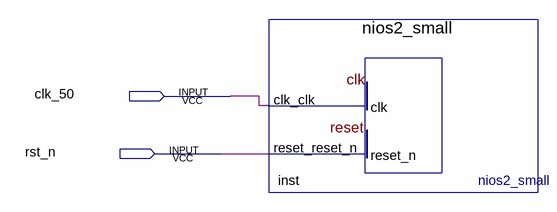
[diagram p0: schematic sheet]
// Quartus schematic Hello_sopc.bdf as structural Verilog: 1 symbols, 2 pins
module Hello_sopc (
  input  clk_50,
  input  rst_n
);

  nios2_small inst (.clk_clk(clk_50), .reset_reset_n(rst_n));
endmodule
